# EAGLE design cpu_board (EAGLE 7.7.0)
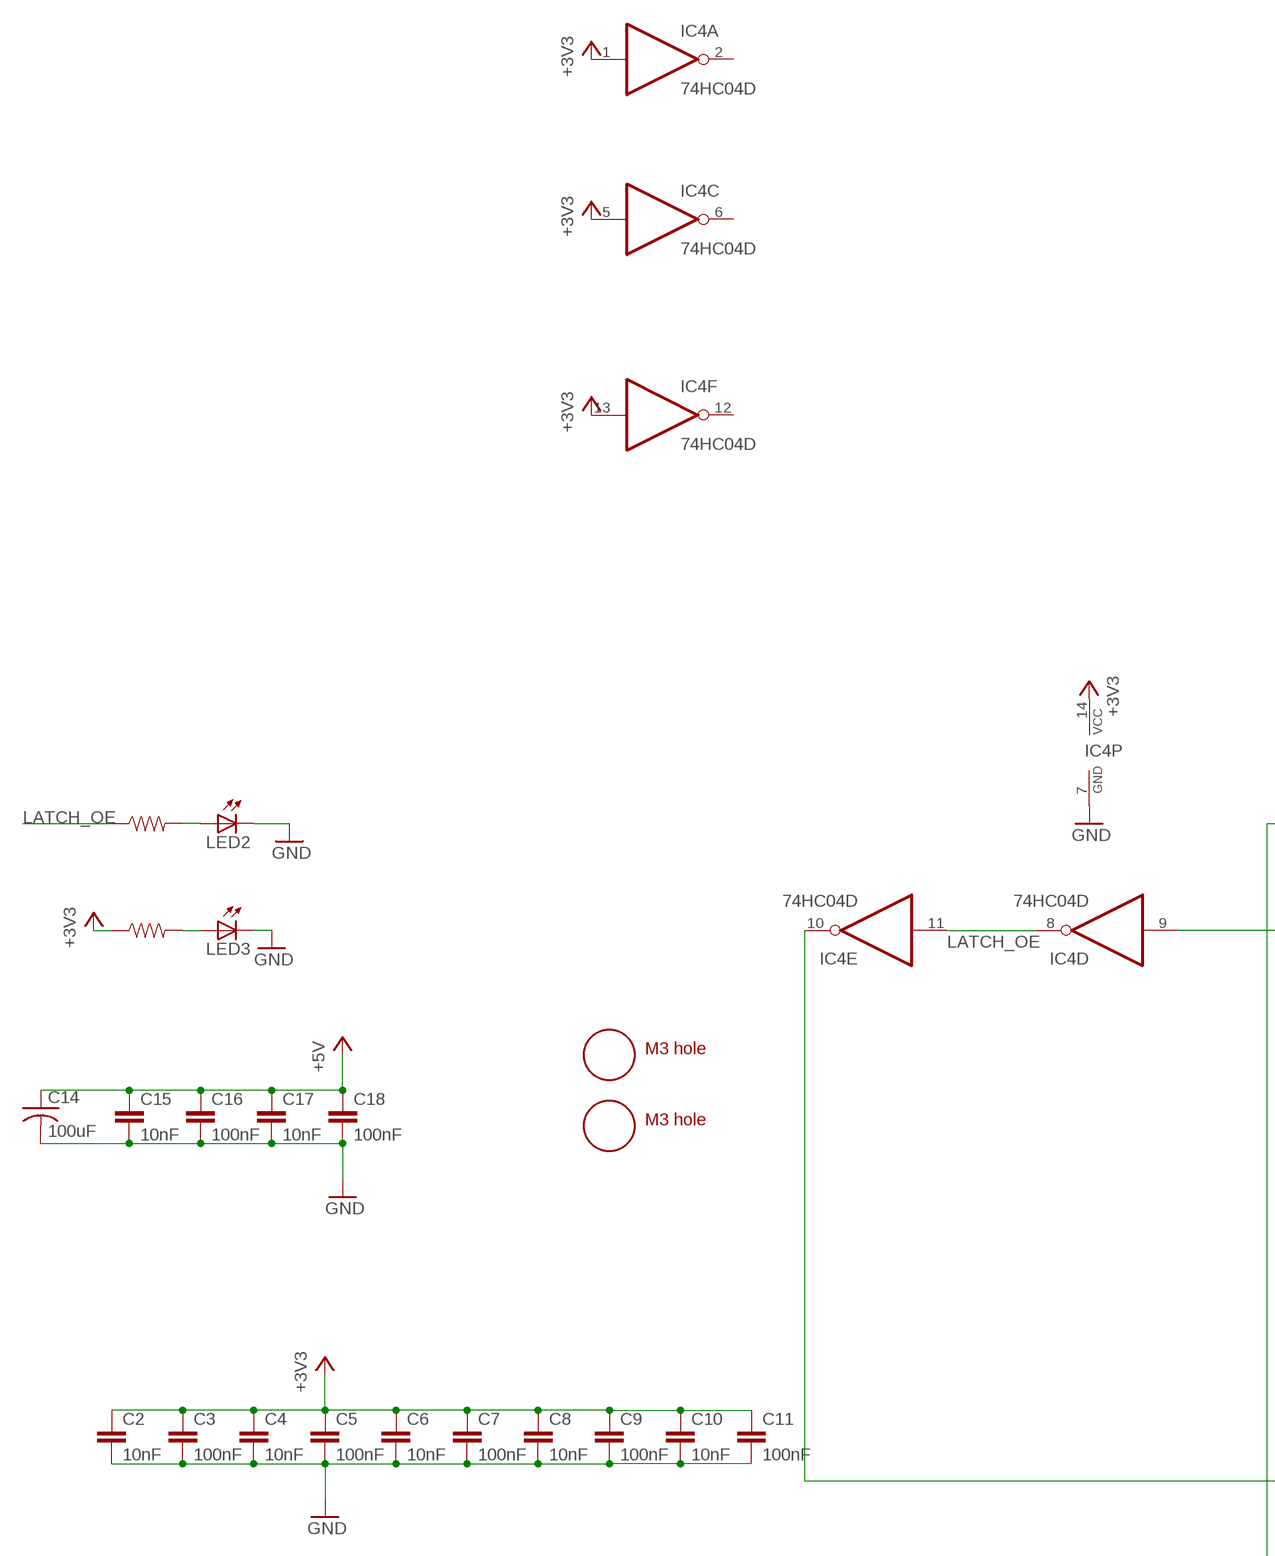
[diagram p0: schematic, sheet 1, part 1 of 2]
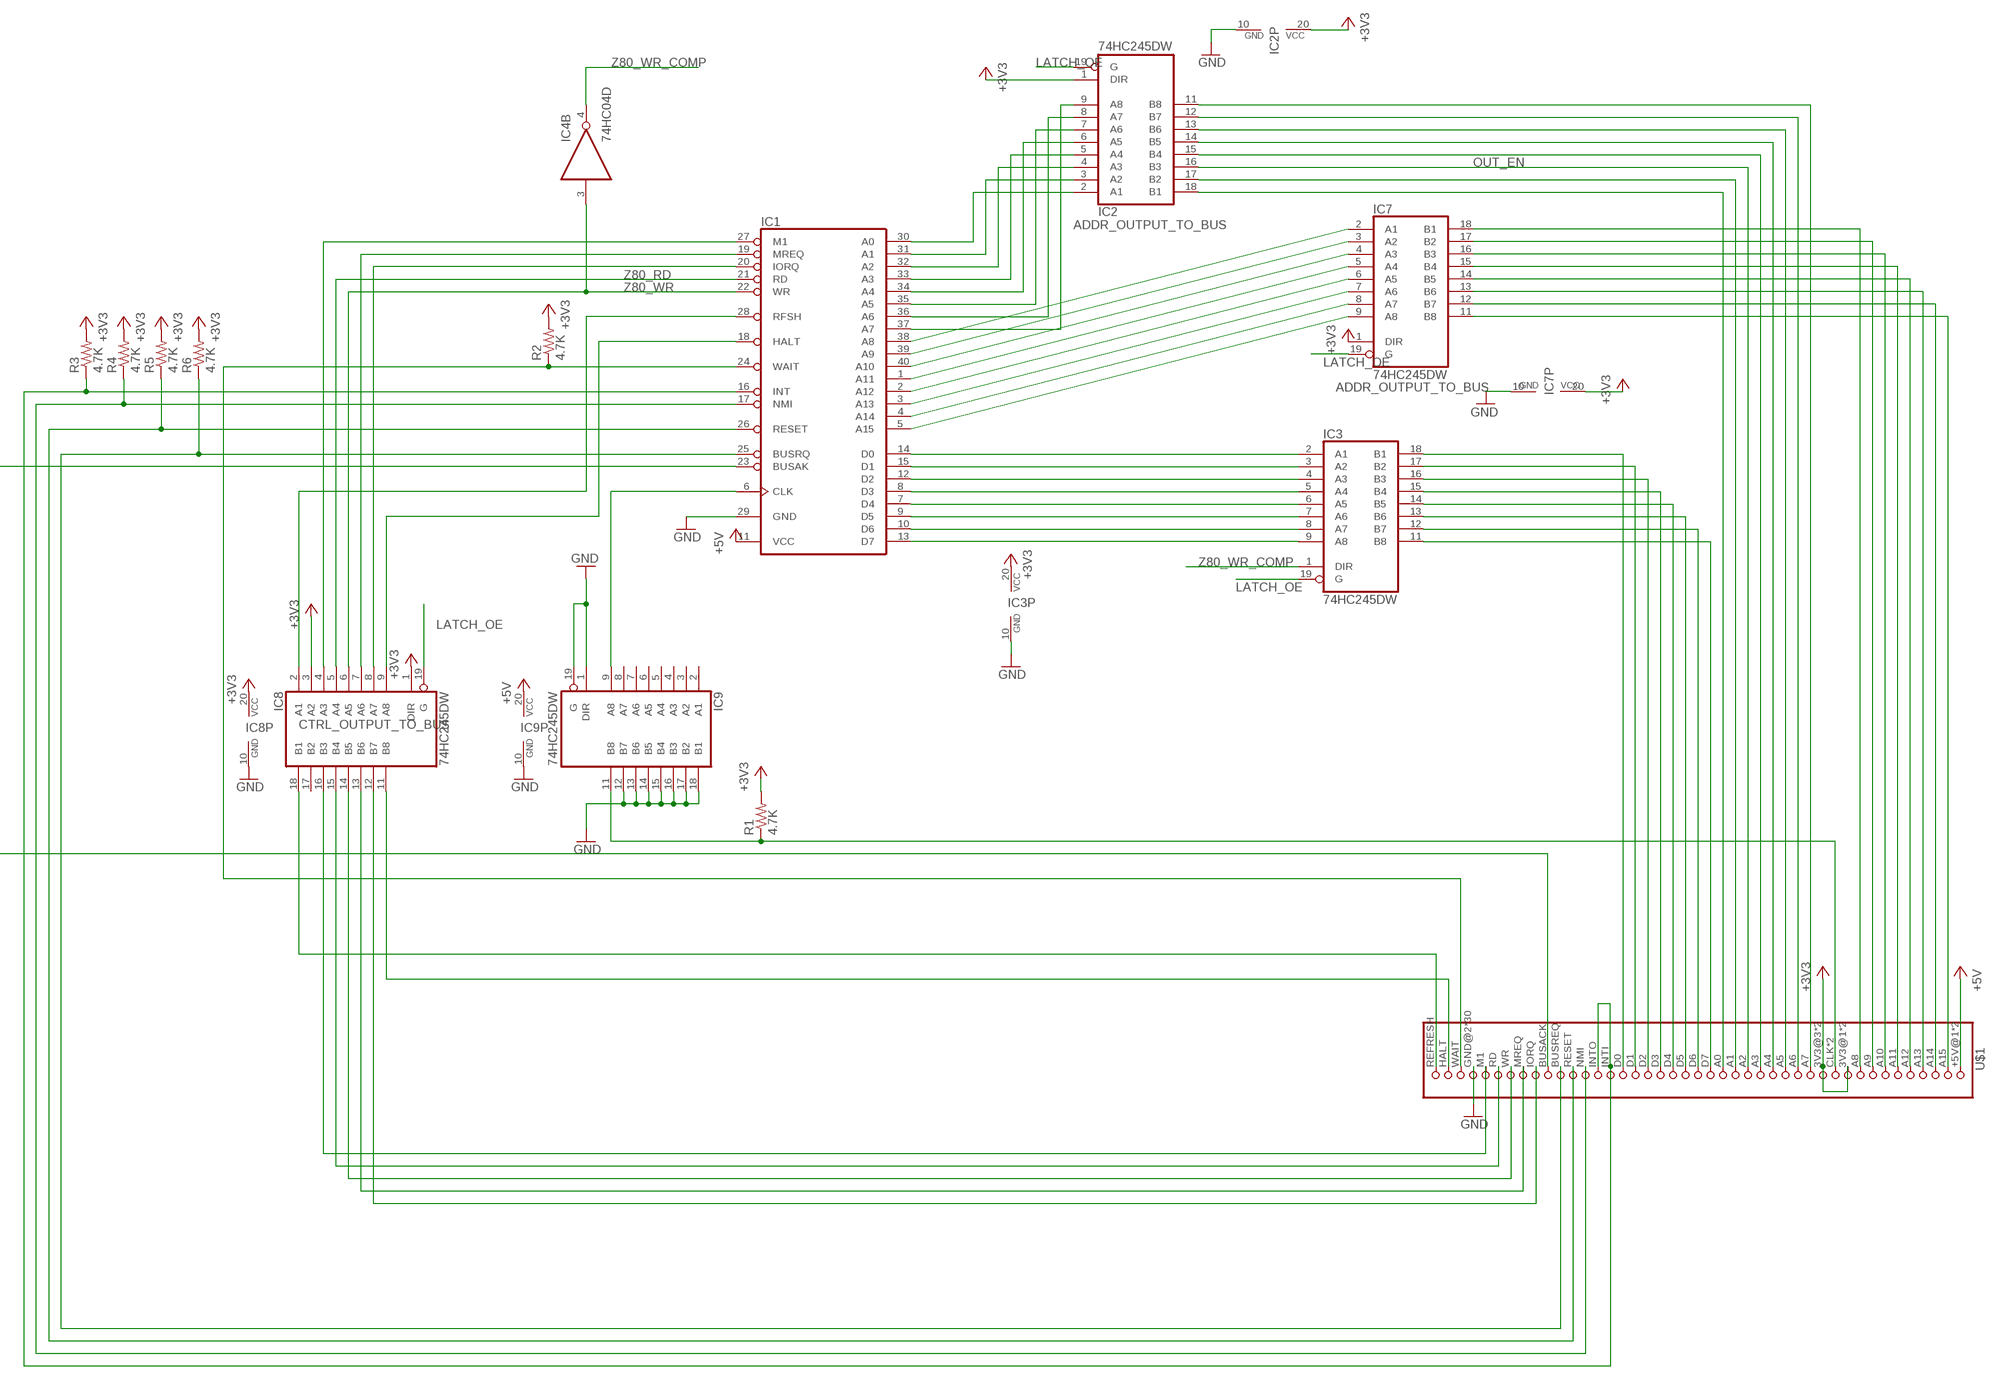
[diagram p1: schematic, sheet 1, part 2 of 2]

## Parts
C2  10nF  22UF-6.3V-20%(0805)  [0805]
C3  100nF  22UF-6.3V-20%(0805)  [0805]
C4  10nF  22UF-6.3V-20%(0805)  [0805]
C5  100nF  22UF-6.3V-20%(0805)  [0805]
C6  10nF  22UF-6.3V-20%(0805)  [0805]
C7  100nF  22UF-6.3V-20%(0805)  [0805]
C8  10nF  22UF-6.3V-20%(0805)  [0805]
C9  100nF  22UF-6.3V-20%(0805)  [0805]
C10  10nF  22UF-6.3V-20%(0805)  [0805]
C11  100nF  22UF-6.3V-20%(0805)  [0805]
C14  100uF  C-USC1210  [C1210]
C15  10nF  22UF-6.3V-20%(0805)  [0805]
C16  100nF  22UF-6.3V-20%(0805)  [0805]
C17  10nF  22UF-6.3V-20%(0805)  [0805]
C18  100nF  22UF-6.3V-20%(0805)  [0805]
IC1  Z80CPU  [DIL40]
IC2  74HC245DW  [SO20W]
IC3  74HC245DW  [SO20W]
IC4  74HC04D  [SO14]
IC7  74HC245DW  [SO20W]
IC8  74HC245DW  [SO20W]
IC9  74HC245DW  [SO20W]
LED2  LEDCHIP-LED0805  [CHIP-LED0805]
LED3  LEDCHIP-LED0805  [CHIP-LED0805]
R1  4.7K  RESISTOR0805-RES  [0805]
R2  4.7K  RESISTOR0805-RES  [0805]
R3  4.7K  RESISTOR0805-RES  [0805]
R4  4.7K  RESISTOR0805-RES  [0805]
R5  4.7K  RESISTOR0805-RES  [0805]
R6  4.7K  RESISTOR0805-RES  [0805]
R7  2K  RESISTOR0805-RES  [0805]
R8  2K  RESISTOR0805-RES  [0805]
U$1  FAP_BUS  [2X38]
U$2  M3_MOUNTING_HOLE  [M3_MOUNTING_HOLE_PACK]
U$3  M3_MOUNTING_HOLE  [M3_MOUNTING_HOLE_PACK]

## Nets
+3V3: C2.1 C3.1 C4.1 C5.1 C6.1 C7.1 C8.1 C9.1 C10.1 C11.1 IC2.1(DIR) IC2.20(VCC) IC3.20(VCC) IC4.1(A:I) IC4.5(C:I) IC4.13(F:I) IC4.14(P:VCC) IC7.1(DIR) IC7.20(VCC) IC8.1(DIR) IC8.3(A2) IC8.20(VCC) R1.2 R2.2 R3.2 R4.2 R5.2 R6.2 R8.1 U$1.3V3@1 U$1.3V3@2 U$1.3V3@3 U$1.3V3@4
+5V: C14.1 C15.1 C16.1 C17.1 C18.1 IC1.11(VCC) IC9.20(VCC) U$1.+5V@1 U$1.+5V@2
GND: C2.2 C3.2 C4.2 C5.2 C6.2 C7.2 C8.2 C9.2 C10.2 C11.2 C14.2 C15.2 C16.2 C17.2 C18.2 IC1.29(GND) IC2.10(GND) IC3.10(GND) IC4.7(P:GND) IC7.10(GND) IC8.10(GND) IC9.1(DIR) IC9.10(GND) IC9.12(B7) IC9.13(B6) IC9.14(B5) IC9.15(B4) IC9.16(B3) IC9.17(B2) IC9.18(B1) IC9.19(G) LED2.C LED3.C U$1.GND@2(GND) U$1.GND@3(GND) U$1.GND@4(GND) U$1.GND@5(GND) U$1.GND@6(GND) U$1.GND@7(GND) U$1.GND@8(GND) U$1.GND@9(GND) U$1.GND@13(GND) U$1.GND@14(GND) U$1.GND@15(GND) U$1.GND@16(GND) U$1.GND@17(GND) U$1.GND@18(GND) U$1.GND@19(GND) U$1.GND@20(GND) U$1.GND@21(GND) U$1.GND@22(GND) U$1.GND@23(GND) U$1.GND@24(GND) U$1.GND@25(GND) U$1.GND@26(GND) U$1.GND@27(GND) U$1.GND@28(GND) U$1.GND@30(GND) U$1.GND@34(GND) U$1.GND@35(GND) U$1.GND@36(GND) U$1.GND@37(GND) U$1.GND@38(GND)
LATCH_OE: IC2.19(G) IC3.19(G) IC4.8(D:O) IC4.11(E:I) IC7.19(G) IC8.19(G) R7.1
N$1: IC1.38(A8) IC7.2(A1)
N$2: IC1.39(A9) IC7.3(A2)
N$3: IC1.40(A10) IC7.4(A3)
N$4: IC1.1(A11) IC7.5(A4)
N$5: IC1.2(A12) IC7.6(A5)
N$6: IC1.3(A13) IC7.7(A6)
N$7: IC1.4(A14) IC7.8(A7)
N$8: IC1.5(A15) IC7.9(A8)
N$9: IC1.37(A7) IC2.9(A8)
N$10: IC1.36(A6) IC2.8(A7)
N$11: IC1.35(A5) IC2.7(A6)
N$12: IC1.34(A4) IC2.6(A5)
N$13: IC1.33(A3) IC2.5(A4)
N$14: IC1.32(A2) IC2.4(A3)
N$15: IC1.31(A1) IC2.3(A2)
N$16: IC1.30(A0) IC2.2(A1)
N$17: IC1.14(D0) IC3.2(A1)
N$18: IC1.15(D1) IC3.3(A2)
N$19: IC1.12(D2) IC3.4(A3)
N$20: IC1.8(D3) IC3.5(A4)
N$21: IC1.7(D4) IC3.6(A5)
N$22: IC1.9(D5) IC3.7(A6)
N$23: IC1.10(D6) IC3.8(A7)
N$24: IC1.13(D7) IC3.9(A8)
N$25: IC4.10(E:O) U$1.BUSACK
N$26: IC9.11(B8) R1.1 U$1.CLK U$1.CLK@2
N$27: IC1.6(CLK) IC9.9(A8)
N$28: LED2.A R7.2
N$29: IC1.25(BUSRQ) R6.1 U$1.BUSREQ
N$30: IC1.23(BUSAK) IC4.9(D:I)
N$31: IC1.26(RESET) R5.1 U$1.RESET
N$32: IC1.24(WAIT) R2.1 U$1.WAIT
N$33: IC1.17(NMI) R4.1 U$1.NMI
N$34: IC1.18(HALT) IC8.9(A8)
N$35: IC1.16(INT) R3.1 U$1.INTI U$1.INTO
N$36: IC1.19(MREQ) IC8.7(A6)
N$37: IC8.11(B8) U$1.HALT
N$38: IC1.28(RFSH) IC8.2(A1)
N$39: IC1.20(IORQ) IC8.8(A7)
N$40: IC1.27(M1) IC8.4(A3)
N$41: IC8.16(B3) U$1.M1
N$42: IC8.13(B6) U$1.MREQ
N$43: IC8.15(B4) U$1.RD
N$44: IC8.14(B5) U$1.WR
N$45: IC8.12(B7) U$1.IORQ
N$46: IC3.17(B2) U$1.D1
N$47: IC3.11(B8) U$1.D7
N$48: IC3.12(B7) U$1.D6
N$49: IC3.13(B6) U$1.D5
N$50: IC3.14(B5) U$1.D4
N$51: IC3.15(B4) U$1.D3
N$52: IC3.16(B3) U$1.D2
N$53: IC3.18(B1) U$1.D0
N$54: IC7.11(B8) U$1.A15
N$55: IC7.12(B7) U$1.A14
N$56: IC7.13(B6) U$1.A13
N$57: IC2.18(B1) U$1.A0
N$58: IC2.17(B2) U$1.A1
N$59: IC2.16(B3) U$1.A2
N$60: IC2.15(B4) U$1.A3
N$61: IC2.14(B5) U$1.A4
N$62: IC2.13(B6) U$1.A5
N$63: IC2.12(B7) U$1.A6
N$64: IC2.11(B8) U$1.A7
N$65: IC7.14(B5) U$1.A12
N$66: IC7.15(B4) U$1.A11
N$67: IC7.16(B3) U$1.A10
N$68: IC7.17(B2) U$1.A9
N$69: IC7.18(B1) U$1.A8
N$70: IC8.18(B1) U$1.REFRESH
N$82: LED3.A R8.2
Z80_RD: IC1.21(RD) IC8.5(A4)
Z80_WR: IC1.22(WR) IC4.3(B:I) IC8.6(A5)
Z80_WR_COMP: IC3.1(DIR) IC4.4(B:O)
Unconnected: IC4.2(A:O) IC4.6(C:O) IC4.12(F:O) IC8.17(B2) IC9.2(A1) IC9.3(A2) IC9.4(A3) IC9.5(A4) IC9.6(A5) IC9.7(A6) IC9.8(A7)

## Notes on the sheet
- ADDR_OUTPUT_TO_BUS
- ADDR_OUTPUT_TO_BUS
- CTRL_OUTPUT_TO_BUS

## Library data of the parts
C2-C11 C15-C18 = SparkFun-Capacitors:22UF-6.3V-20%(0805): CAP-08402 Ceramic; PROD_ID: CAP-08402; VALUE: 22uF
C14 = adafruit:C-US: CAPACITOR, American symbol
IC1 = zilog:Z80CPU: Z80 FAMILY DEVICE
IC2 IC3 IC7-IC9 = 74xx-eu:74*245: Octal BUS TRANSCEIVER, 3-state
IC4 = 74xx-eu:74*04: Hex INVERTER
LED2 LED3 = adafruit:LED: LED OSRAM: - CHIPLED LG R971, LG N971, LY N971, LG Q971, LY Q971, LO R971, LY R971 LH N974, LH R974 LS Q976, LO Q976, LY Q976 LO Q996 - Hyper CHIPLED LW Q18S LB Q993, LB Q99A, LB R99A - SideLED LS A670, LO A670, LY A670, LG A670, LP A670 LB A673, LV A673, LT A673, LW A673 LH A674 LY A675 LS A676, LA A676, LO A676, LY A676, LW A676 LS A679, LY A679, LG A679 - Hyper Micro SIDELED® LS Y876, LA Y876, LO Y876, LY Y876 LT Y87S - SmartLED LW L88C, LW L88S LB L89C, LB L89S, LG L890 LS L89K, LO L89K, LY L89K LS L896, LA L896, LO L896, LY L896 - TOPLED LS T670, LO T670, LY T670, LG T670, LP T670 LSG T670, LSP T670, LSY T670, LOP T670, LYG T670 LG T671, LOG T671, LSG T671 LB T673, LV T673, LT T673, LW T673 LH T674 LS T676, LA T676, LO T676, LY T676, LB T676, LH T676, LSB T676, LW T676 LB T67C, LV T67C, LT T67C, LS T67K, LO T67K, LY T67K, LW E67C LS E67B, LA E67B, LO E67B, LY E67B, LB E67C, LV E67C, LT E67C LW T67C LS T679, LY T679, LG T679 LS T770, LO T770, LY T770, LG T770, LP T770 LB T773, LV T773, LT T773, LW T773 LH T774 LS E675, LA E675, LY E675, LS T675 LS T776, LA T776, LO T776, LY T776, LB T776 LHGB T686 LT T68C, LB T68C - Hyper Mini TOPLED® LB M676 - Mini TOPLED Santana® LG M470 LS M47K, LO M47K, LY M47K Source: http://www.osram.convergy.de/
R1-R6 = SparkFun-Resistors:RESISTOR: Resistor Basic schematic elements and footprints for 0603, 1206, and PTH resistors.
R7 R8 = SparkFun-Passives:RESISTOR: Resistor Basic schematic elements and footprints for 0603, 1206, and PTH resistors.
U$1 = fap_bus:FAP_BUS
U$2 U$3 = m3_mounting_hole:M3_MOUNTING_HOLE

## Board
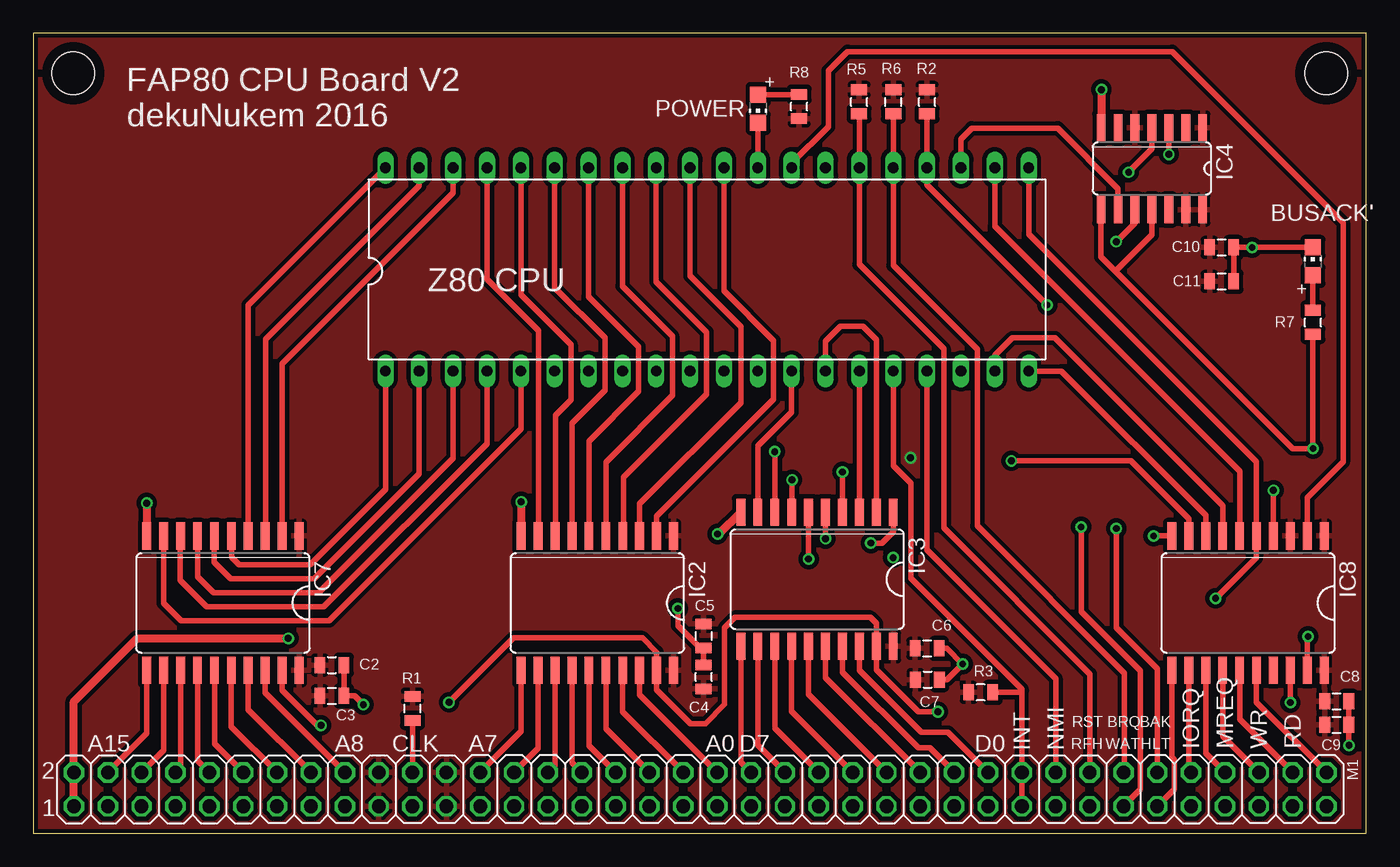
[diagram p2: board, top side]
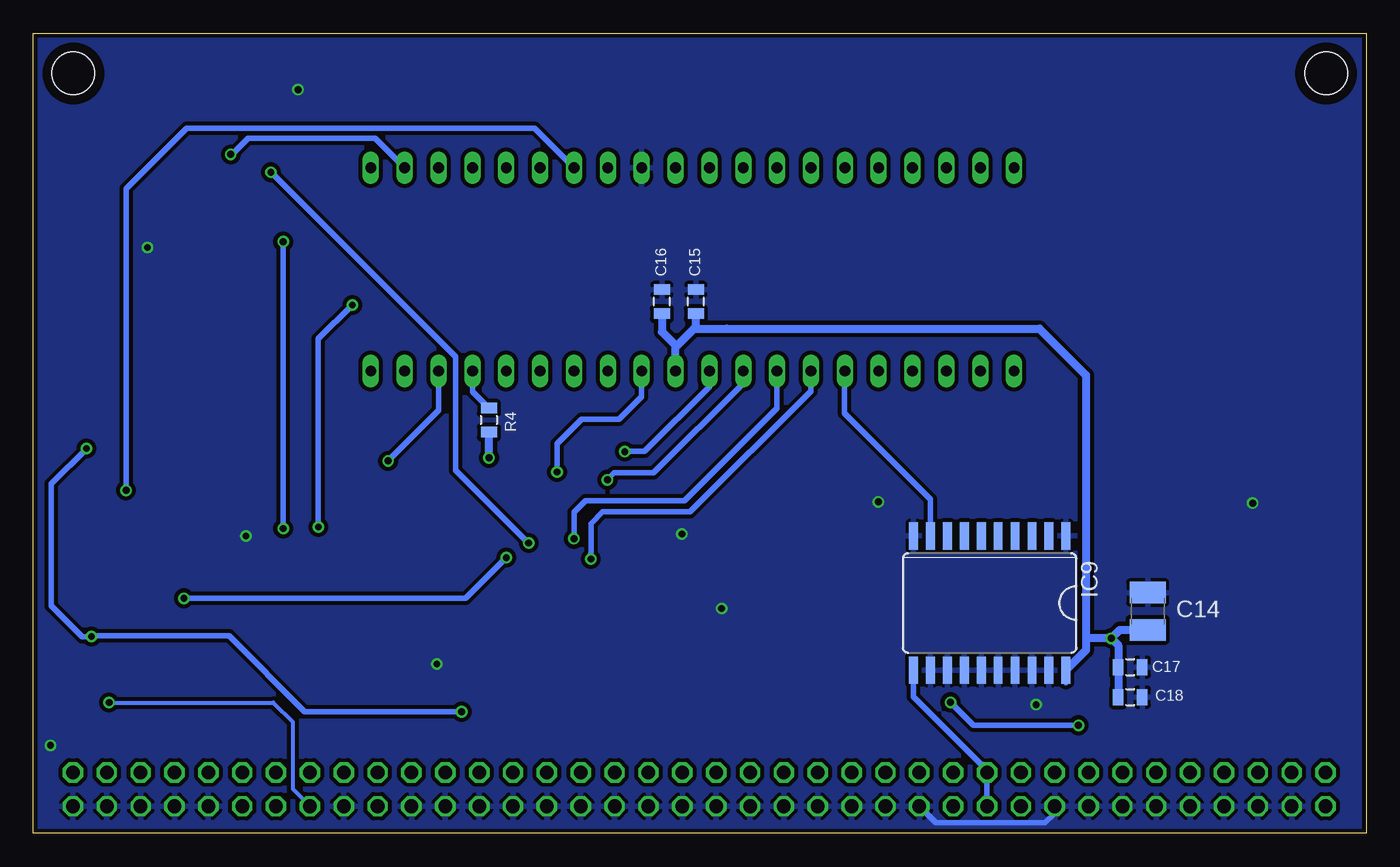
[diagram p3: board, bottom side, seen from below]

Size 100 x 60 mm. Coordinates in mm from the lower left corner, seen from the top.
Outline: 0,0 100,0 100,60 0,60 0,0
Copper layers (1*16): Top 0.035mm / dielectric 1.5mm / Bottom 0.035mm
Design rules "SparkFun-2-layer-TIGHT": minimum track width 7mil, minimum drill 15mil, track to track 7mil, track to pad 7mil, pad to pad 7mil, via to via 7mil, smd to smd 7mil, copper to edge 7mil, drill to drill 7mil, minimum pad ring 7mil, minimum via ring 7mil, stop-mask expansion 4mil, vias tented up to drill 25mil, thermal gap 10mil

### Footprints (pad centres in the part's own frame; a part is rotated, then mirrored left to right if it is on the bottom)
0805 = smd 0.8 x 1.2: 1 -0.9,0; 2 0.9,0
C1210 = smd 1.6 x 2.7: 1 -1.4,0; 2 1.4,0
DIL40 = drill 0.813 long: 1 -24.13,-7.62; 2 -21.59,-7.62; 3 -19.05,-7.62; 4 -16.51,-7.62; 5 -13.97,-7.62; 6 -11.43,-7.62; 7 -8.89,-7.62; 8 -6.35,-7.62; 9 -3.81,-7.62; 10 -1.27,-7.62; 11 1.27,-7.62; 12 3.81,-7.62; 13 6.35,-7.62; 14 8.89,-7.62; 15 11.43,-7.62; 16 13.97,-7.62; 17 16.51,-7.62; 18 19.05,-7.62; 19 21.59,-7.62; 20 24.13,-7.62; 21 24.13,7.62; 22 21.59,7.62; 23 19.05,7.62; 24 16.51,7.62; 25 13.97,7.62; 26 11.43,7.62; 27 8.89,7.62; 28 6.35,7.62; 29 3.81,7.62; 30 1.27,7.62; 31 -1.27,7.62; 32 -3.81,7.62; 33 -6.35,7.62; 34 -8.89,7.62; 35 -11.43,7.62; 36 -13.97,7.62; 37 -16.51,7.62; 38 -19.05,7.62; 39 -21.59,7.62; 40 -24.13,7.62
SO20W = smd 0.66 x 2.032: 1 -5.715,-5.029; 2 -4.445,-5.029; 3 -3.175,-5.029; 4 -1.905,-5.029; 5 -0.635,-5.029; 6 0.635,-5.029; 7 1.905,-5.029; 8 3.175,-5.029; 9 4.445,-5.029; 10 5.715,-5.029; 11 5.715,5.029; 12 4.445,5.029; 13 3.175,5.029; 14 1.905,5.029; 15 0.635,5.029; 16 -0.635,5.029; 17 -1.905,5.029; 18 -3.175,5.029; 19 -4.445,5.029; 20 -5.715,5.029
SO14 = smd 0.66 x 2.032: 1 -3.81,-3.073; 2 -2.54,-3.073; 3 -1.27,-3.073; 4 0,-3.073; 5 1.27,-3.073; 6 2.54,-3.073; 7 3.81,-3.073; 8 3.81,3.073; 9 2.54,3.073; 10 1.27,3.073; 11 0,3.073; 12 -1.27,3.073; 13 -2.54,3.073; 14 -3.81,3.073
CHIP-LED0805 = smd 1.2 x 1.2: A 0,-1.05; C 0,1.05
2X38 = drill 1.016 octagon: 3V3@1 -6.35,0; 3V3@2 -6.35,2.54; 3V3@3 -1.27,0; 3V3@4 -1.27,2.54; +5V@1 -29.21,2.54; +5V@2 -29.21,0; A0 19.05,2.54; A1 16.51,2.54; A2 13.97,2.54; A3 11.43,2.54; A4 8.89,2.54; A5 6.35,2.54; A6 3.81,2.54; A7 1.27,2.54; A8 -8.89,2.54; A9 -11.43,2.54; A10 -13.97,2.54; A11 -16.51,2.54; A12 -19.05,2.54; A13 -21.59,2.54; A14 -24.13,2.54; A15 -26.67,2.54; BUSACK 52.07,2.54; BUSREQ 49.53,2.54; CLK -3.81,2.54; CLK@2 -3.81,0; D0 39.37,2.54; D1 36.83,2.54; D2 34.29,2.54; D3 31.75,2.54; D4 29.21,2.54; D5 26.67,2.54; D6 24.13,2.54; D7 21.59,2.54; GND@2 -26.67,0; GND@3 -24.13,0; GND@4 -21.59,0; GND@5 -19.05,0; GND@6 -16.51,0; GND@7 -13.97,0; GND@8 -11.43,0; GND@9 -8.89,0; GND@13 1.27,0; GND@14 3.81,0; GND@15 6.35,0; GND@16 8.89,0; GND@17 11.43,0; GND@18 13.97,0; GND@19 16.51,0; GND@20 19.05,0; GND@21 21.59,0; GND@22 24.13,0; GND@23 26.67,0; GND@24 29.21,0; GND@25 31.75,0; GND@26 34.29,0; GND@27 36.83,0; GND@28 39.37,0; GND@30 44.45,0; GND@34 54.61,0; GND@35 57.15,0; GND@36 59.69,0; GND@37 62.23,0; GND@38 64.77,0; HALT 52.07,0; INTI 41.91,0; INTO 41.91,2.54; IORQ 54.61,2.54; M1 64.77,2.54; MREQ 57.15,2.54; NMI 44.45,2.54; RD 62.23,2.54; REFRESH 46.99,0; RESET 46.99,2.54; WAIT 49.53,0; WR 59.69,2.54
M3_MOUNTING_HOLE_PACK = hole 3.2: 0,0

### Placement (x,y rotation side)
C2  22.4,12.62 0 top
C3  22.4,10.31 0 top
C4  50.29,11.73 90 top
C5  50.29,14.81 270 top
C6  67.06,13.87 0 top
C7  67.08,11.53 0 top
C8  97.79,9.91 0 top
C9  97.79,8.13 0 top
C10  89.15,43.94 0 top
C11  89.15,41.4 0 top
C14  16.38,16.66 90 bottom
C15  50.29,39.88 90 bottom
C16  52.83,39.88 90 bottom
C17  17.7,12.47 0 bottom
C18  17.7,10.21 0 bottom
IC1  50.55,42.29 0 top
IC2  42.32,17.27 180 top
IC3  58.8,19.05 180 top
IC4  83.92,49.86 180 top
IC7  14.22,17.27 180 top
IC8  91.14,17.27 180 top
IC9  28.24,17.27 180 bottom
LED2  96.01,42.9 0 top
LED3  54.38,54.36 180 top
R1  28.45,9.37 90 top
R2  67.06,54.86 90 top
R3  71.07,10.57 180 top
R4  65.81,30.99 270 bottom
R5  61.95,54.86 90 top
R6  64.52,54.86 90 top
R7  96.01,38.33 90 top
R8  57.45,54.51 90 top
U$1  32.26,2.03 0 top
U$2  3,57 0 top
U$3  97,57 0 top

### Tracks (layer width: path | path; a pad name or v marks a point on that pad's centre or on a via)
+3V3  (via drill 0.51)
  Bottom 0.61: v65.81,28.17 R4.2
  pour Top (isolate 0.33): 0,60.76 0,0 100.08,0 100.08,60.76
+5V  (via drill 0.51)
  Top 0.61: U$1.+5V@2 U$1.+5V@1 3.05,9.88 7.8,14.63 v19.13,14.63
  Bottom 0.406: 22.53,11.28 IC9.20 | 48.01,37.87 47.98,37.85 | C15.1 50.32,38.95
  Bottom 0.61: IC1.11 51.82,36.47 51.75,36.54 | 51.75,36.54 50.44,37.85 50.32,37.85 | 50.32,37.85 47.98,37.85 24.51,37.85 21.03,34.37 21.03,14.63 | 21.03,14.63 21.03,13.74 IC9.20 | v19.13,14.63 21.03,14.63 | 50.32,38.95 50.32,37.85 | C16.1 52.83,37.62 51.75,36.54 | v19.13,14.63 18.6,14.11 C17.1 C18.1 | v19.13,14.63 18.49,15.26 C14.1
GND  (via drill 0.51)
  Top 0.406: v51.33,22.45 51.46,22.45 | 80.14,52.96 IC4.7 | v24.77,9.65 24.11,10.31 C3.2 C2.2 | C4.2 C5.2 50.02,13.91 48.36,15.57 v48.36,16.87 | C6.2 68.56,13.87 v69.72,12.7 68.56,11.53 C7.2 | v98.7,6.6 98.69,6.62 C9.2 C8.2 | v84.05,22.3 IC8.10 | C11.2 C10.2 v91.44,43.94 LED2.C | LED3.C 54.36,53.28 IC1.29
  Top 0.61: 51.46,22.45 IC3.10 | v36.6,24.87 IC2.10 | v8.51,24.77 IC7.10 | v80.14,55.78 80.14,52.96 | LED2.C
  Bottom 0.406: U$1.GND@13 32.28,0.79 24.11,0.79 23.37,1.52 U$1.GND@9
  pour Bottom (isolate 0.305): 0,0 100.08,0 100.08,61.26 0,61.26
LATCH_OE  (via drill 0.51)
  Top 0.406: IC4.8 80.11,43.23 81.19,42.15 | v95.63,14.76 95.58,14.71 IC8.19 | v21.59,8.1 21.31,8.1 18.67,10.74 IC7.19 | v31.19,9.83 36.02,14.66 45.7,14.66 46.76,13.59 IC2.19 46.76,10.77 49.3,8.23 50.42,8.23 51.87,9.68 51.87,15.42 52.65,16.2 62.79,16.2 63.25,15.75 IC3.19 63.25,12.27 66.4,9.12 v67.87,9.12 | R7.1 v96.01,28.85 94.49,28.85 81.19,42.15 | IC4.11 83.92,44.88 81.19,42.15
  Bottom 0.406: v21.59,8.1 29.46,8.1 v31.19,9.83 | v67.87,9.12 79.63,9.12 85.32,14.81 95.58,14.81 v95.63,14.76 96.34,14.76 98.65,17.07 98.65,26.21 v96.01,28.85
N$1
  Top 0.406: IC1.38 31.5,48.06 18.67,35.23 IC7.2
N$2
  Top 0.406: IC1.39 28.96,48.56 17.45,37.06 17.45,22.35 IC7.3
N$3
  Top 0.406: IC1.40 16.13,39.62 IC7.4
N$4
  Top 0.406: IC1.1 26.42,25.81 20.75,20.14 15.44,20.14 14.88,20.7 14.88,22.28 IC7.5
N$5
  Top 0.406: IC1.2 28.96,26.98 21.06,19.07 14.81,19.07 13.56,20.32 13.56,22.28 IC7.6
N$6
  Top 0.406: IC1.3 31.5,28.12 21.41,18.03 13.51,18.03 12.32,19.23 IC7.7
N$7
  Top 0.406: IC1.4 34.04,29.23 21.79,16.99 13.01,16.99 11.02,18.97 11.02,22.28 IC7.8
N$8
  Top 0.406: IC1.5 36.58,30.33 22.2,15.95 11.1,15.95 9.78,17.27 IC7.9
N$9
  Top 0.406: IC1.37 34.04,41.55 37.9,37.69 37.9,22.33 IC2.9
N$10
  Top 0.406: IC1.36 36.58,40.41 40.34,36.65 40.34,32.54 39.17,31.37 39.17,22.33 IC2.8 39.12,22.33
N$11
  Top 0.406: IC1.35 39.12,40.92 42.88,37.16 42.88,33.22 40.41,30.76 IC2.7
N$12
  Top 0.406: IC1.34 41.66,40.26 45.41,36.5 45.41,33.15 41.68,29.41 IC2.6
N$13
  Top 0.406: IC1.33 44.2,41.05 47.95,37.29 47.95,32.84 42.95,27.84 IC2.5
N$14
  Top 0.406: IC1.32 46.74,41.38 50.52,37.59 50.52,32.94 44.27,26.7 44.27,22.35 IC2.4
N$15
  Top 0.406: IC1.31 49.28,41.81 53.09,38 53.09,32.31 45.49,24.71 IC2.3
N$16
  Top 0.406: IC1.30 51.82,40.69 55.55,36.96 55.55,32.56 46.76,23.77 IC2.2
N$17
  Top 0.406: IC1.14 59.44,36.91 60.55,38.02 62.26,38.02 63.25,37.03 IC3.2
N$18
  Top 0.406: IC1.15 IC3.3
N$19  (via drill 0.51)
  Top 0.406: v60.71,27.1 IC3.4
  Bottom 0.406: IC1.12 54.36,32.74 56.06,31.04 58.88,31.04 60.71,29.21 v60.71,27.1
N$20  (via drill 0.51)
  Top 0.406: IC3.5 v59.44,22.1
  Bottom 0.406: IC1.8 44.2,31.88 51.13,24.94 58.57,24.94 IC3.5 v59.44,22.1
N$21  (via drill 0.51)
  Top 0.406: v58.17,20.57 IC3.6
  Bottom 0.406: IC1.7 41.66,33.17 50.72,24.11 57.28,24.11 58.17,23.22 v58.17,20.57
N$22  (via drill 0.51 pad 0.41)
  Top 0.406: v56.92,26.52 56.92,24.11 IC3.7
  Bottom 0.406: IC1.9 46.74,33.76 53.47,27.03 56.41,27.03 v56.92,26.52
N$23  (via drill 0.51 pad 0.41)
  Top 0.406: v55.63,28.63 IC3.8
  Bottom 0.406: IC1.10 49.28,33.5 54.13,28.65 55.6,28.65 v55.63,28.63
N$24
  Top 0.406: IC1.13 56.9,31.6 54.38,29.08 54.38,24.11 IC3.9
N$25  (via drill 0.51)
  Top 0.406: U$1.BUSACK 84.33,12.34 81.25,15.42 v81.25,22.86 | IC4.10 82.65,45.77 v81.25,44.37
  Bottom 0.406: v81.25,44.37 v81.25,22.86
N$26
  Top 0.406: R1.1 U$1.CLK
  Bottom 0.406: IC9.11 33.96,10.24 28.45,4.72 U$1.CLK | U$1.CLK 28.45,4.06 | U$1.CLK@2 U$1.CLK
N$27
  Bottom 0.406: IC9.9 32.69,25.04 39.14,31.5 39.14,34.65 IC1.6
N$28
  Top 0.406: R7.2 LED2.A
N$29
  Top 0.406: U$1.BUSREQ 81.86,4.65 81.86,12.01 70.81,23.06 70.81,36.3 64.52,42.6 IC1.25 R6.1
N$30
  Top 0.406: IC1.23 69.6,52.07 70.41,52.88 76.86,52.88 81.38,48.36 IC4.9
N$31
  Top 0.406: U$1.RESET 79.27,4.6 79.27,11.94 68.3,22.91 68.3,36.35 61.98,42.67 IC1.26 61.98,53.94 R5.1
N$32  (via drill 0.5)
  Top 0.406: R2.1 IC1.24 67.06,48.64 v76.07,39.62 | v78.61,22.99 78.61,16.64 83.06,12.19 83.06,3.3 U$1.WAIT
  Bottom 0.406: v76.07,39.62 78.61,37.08 v78.61,22.99
N$33
  Top 0.406: IC1.17 67.06,21.26 76.71,11.61 U$1.NMI
  Bottom 0.406: R4.1 67.06,33.13 IC1.17
N$34  (via drill 0.5)
  Top 0.406: v73.38,27.94 82.35,27.94 86.69,23.6 IC8.9
  Bottom 0.406: IC1.18 69.6,31.73 v73.38,27.94
N$35
  Top 0.406: IC1.16 64.52,27.58 65.86,26.24 65.86,19.13 74.17,10.82 74.17,10.62 74.12,10.57 74.04,10.57 | R3.1 74.04,10.57 | 74.04,10.57 74.17,10.44 U$1.INTO U$1.INTI
N$36
  Top 0.406: IC1.19 72.14,35.84 73.46,37.16 76.66,37.16 89.23,24.59 IC8.7
N$37
  Top 0.406: IC8.11 85.42,5.69 85.6,5.51 85.6,3.3 U$1.HALT
N$38
  Top 0.406: IC1.28 56.9,50.24 59.64,52.98 59.64,57.17 61.09,58.62 85.45,58.62 98.27,45.8 98.27,27.86 95.58,25.17 IC8.2
N$39
  Top 0.406: IC1.20 77.14,34.67 87.96,23.85 IC8.8
N$40  (via drill 0.51)
  Top 0.406: v93.04,25.73 IC8.4
  Bottom 0.406: IC1.27 62.41,52.88 88.49,52.88 93.04,48.34 v93.04,25.73
N$41
  Top 0.406: IC8.16 91.77,9.83 U$1.M1
N$42
  Top 0.406: IC8.13 87.96,6.02 U$1.MREQ
N$43
  Top 0.406: IC8.15 90.5,8.56 U$1.RD
N$44
  Top 0.406: IC8.14 89.23,7.29 U$1.WR
N$45
  Top 0.406: IC8.12 86.69,4.75 U$1.IORQ
N$46
  Top 0.406: IC3.17 60.71,12.09 66.4,6.4 67.26,6.4 U$1.D1
N$47
  Top 0.406: IC3.11 53.09,5.33 U$1.D7
N$48
  Top 0.406: IC3.12 54.36,6.6 U$1.D6
N$49
  Top 0.406: IC3.13 55.63,7.87 U$1.D5
N$50
  Top 0.406: IC3.14 56.9,9.14 U$1.D4
N$51
  Top 0.406: IC3.15 58.17,10.41 U$1.D3
N$52
  Top 0.406: IC3.16 59.44,11.68 U$1.D2
N$53
  Top 0.406: IC3.18 61.98,12.22 66.62,7.57 68.63,7.57 U$1.D0
N$54
  Top 0.406: IC7.11 8.51,7.49 U$1.A15
N$55
  Top 0.406: IC7.12 9.78,6.22 U$1.A14
N$56
  Top 0.406: IC7.13 11.05,4.95 U$1.A13
N$57
  Top 0.406: IC2.18 45.49,10.39 U$1.A0
N$58
  Top 0.406: IC2.17 44.22,9.12 U$1.A1
N$59
  Top 0.406: IC2.16 42.95,7.85 U$1.A2
N$60
  Top 0.406: IC2.15 41.68,6.58 U$1.A3
N$61
  Top 0.406: IC2.14 40.41,5.31 U$1.A4
N$62
  Top 0.406: IC2.13 39.14,5.11 U$1.A5
N$63
  Top 0.406: IC2.12 37.87,6.38 U$1.A6
N$64
  Top 0.406: IC2.11 36.6,7.64 U$1.A7
N$65
  Top 0.406: IC7.14 12.32,5.46 U$1.A12
N$66
  Top 0.406: IC7.15 13.59,6.73 U$1.A11
N$67
  Top 0.406: IC7.16 14.86,8 U$1.A10
N$68
  Top 0.406: IC7.17 16.13,9.27 U$1.A9
N$69
  Top 0.406: IC7.18 17.4,10.54 U$1.A8
N$70  (via drill 0.5)
  Top 0.406: IC8.18 v94.31,9.8
  Bottom 0.305: v94.31,9.8 81.99,9.8 80.54,8.36 80.54,3.33 U$1.REFRESH
N$82
  Top 0.406: R8.2 LED3.A
Z80_RD  (via drill 0.51)
  Top 0.406: IC1.21 74.68,44.93 91.75,27.86 91.75,22.33 | 91.75,22.33 IC8.5 | 91.75,22.33 91.75,20.65 88.72,17.63 v88.7,17.63
  Bottom 0.406: v88.7,17.63 67.56,17.63 v64.52,20.68
Z80_WR  (via drill 0.5)
  Top 0.406: IC1.22 72.14,45.52 90.5,27.15 IC8.6 | v85.19,50.93 IC4.3
  Bottom 0.406: IC1.22 74.35,52.12 83.9,52.12 85.09,50.93 v85.19,50.93
Z80_WR_COMP  (via drill 0.5)
  Top 0.406: v62.84,21.77 63.68,21.77 64.52,22.61 IC3.1 | v82.17,49.58 83.92,51.33 IC4.4
  Bottom 0.406: v62.84,21.77 68.3,27.23 68.3,35.74 82.14,49.58 v82.17,49.58

### Text on the board
tNames: POWER | FAP80 CPU Board V2 / dekuNukem 2016 | BUSACK' | Z80 CPU | RST | BRQ | BAK | RFH | WAT | HLT | A15 | A8 | CLK | A7 | A0 | D7 | D0 | INT | NMI | IORQ | MREQ | WR | RD | 2 | M1 | 1